# EAGLE design lab2_task2 (EAGLE 6.5.0)
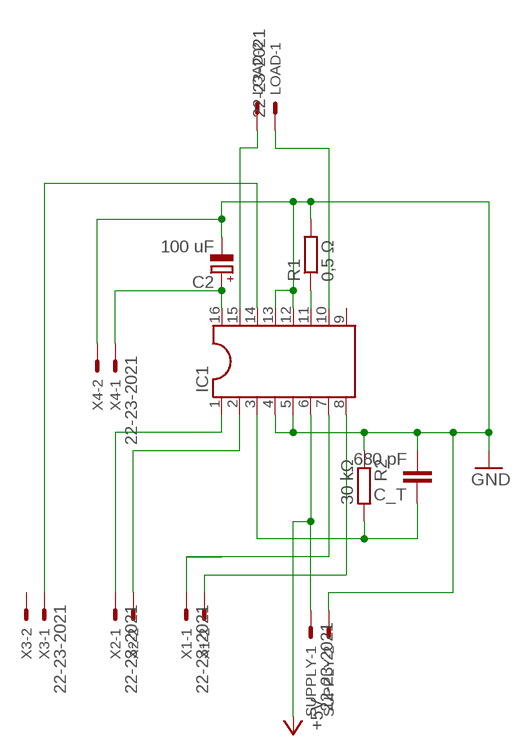
[diagram p0: schematic, sheet 1]

## Parts
C2  100 uF  CPOL-EUE5-13  [E5-13]
C_T  680 pF  C-EU050-035X075  [C050-035X075]
IC1  DIL16  [DIL16]
LOAD  22-23-2021  [22-23-2021]
R1  0,5 Ω  R-EU_0207/10  [0207/10]
R2  30 kΩ  R-EU_0207/10  [0207/10]
SUPPLY  22-23-2021  [22-23-2021]
X1  22-23-2021  [22-23-2021]
X2  22-23-2021  [22-23-2021]
X3  22-23-2021  [22-23-2021]
X4  22-23-2021  [22-23-2021]

## Nets
+5V: IC1.6 SUPPLY.1
GND: C2.- C_T.2 IC1.4 IC1.5 IC1.12 IC1.13 R1.2 R2.1 SUPPLY.2 X4.2
N$1: IC1.7 X1.1
N$2: IC1.8 X1.2
N$3: C_T.1 IC1.3 R2.2
N$4: C2.+ IC1.16 X4.1
N$6: IC1.11 R1.1
N$7: IC1.2 X2.2
N$8: IC1.10 LOAD.1
N$9: IC1.1 X2.1
N$11: IC1.15 LOAD.2
N$13: IC1.14 X3.1
Unconnected: IC1.9 X3.2

## Library data of the parts
C2 = resistor:CPOL-EU: POLARIZED CAPACITOR, European symbol
C_T = resistor:C-EU: CAPACITOR, European symbol
IC1 = ic-package:DIL16: Dual In Line / Socket
LOAD SUPPLY X1-X4 = con-molex:22-23-2021: .100" (2.54mm) Center Header - 2 Pin; MF: MOLEX; MPN: 22-23-2021; OC_FARNELL: 1462926; OC_NEWARK: 25C3832
R1 R2 = resistor:R-EU_: RESISTOR, European symbol

## Board
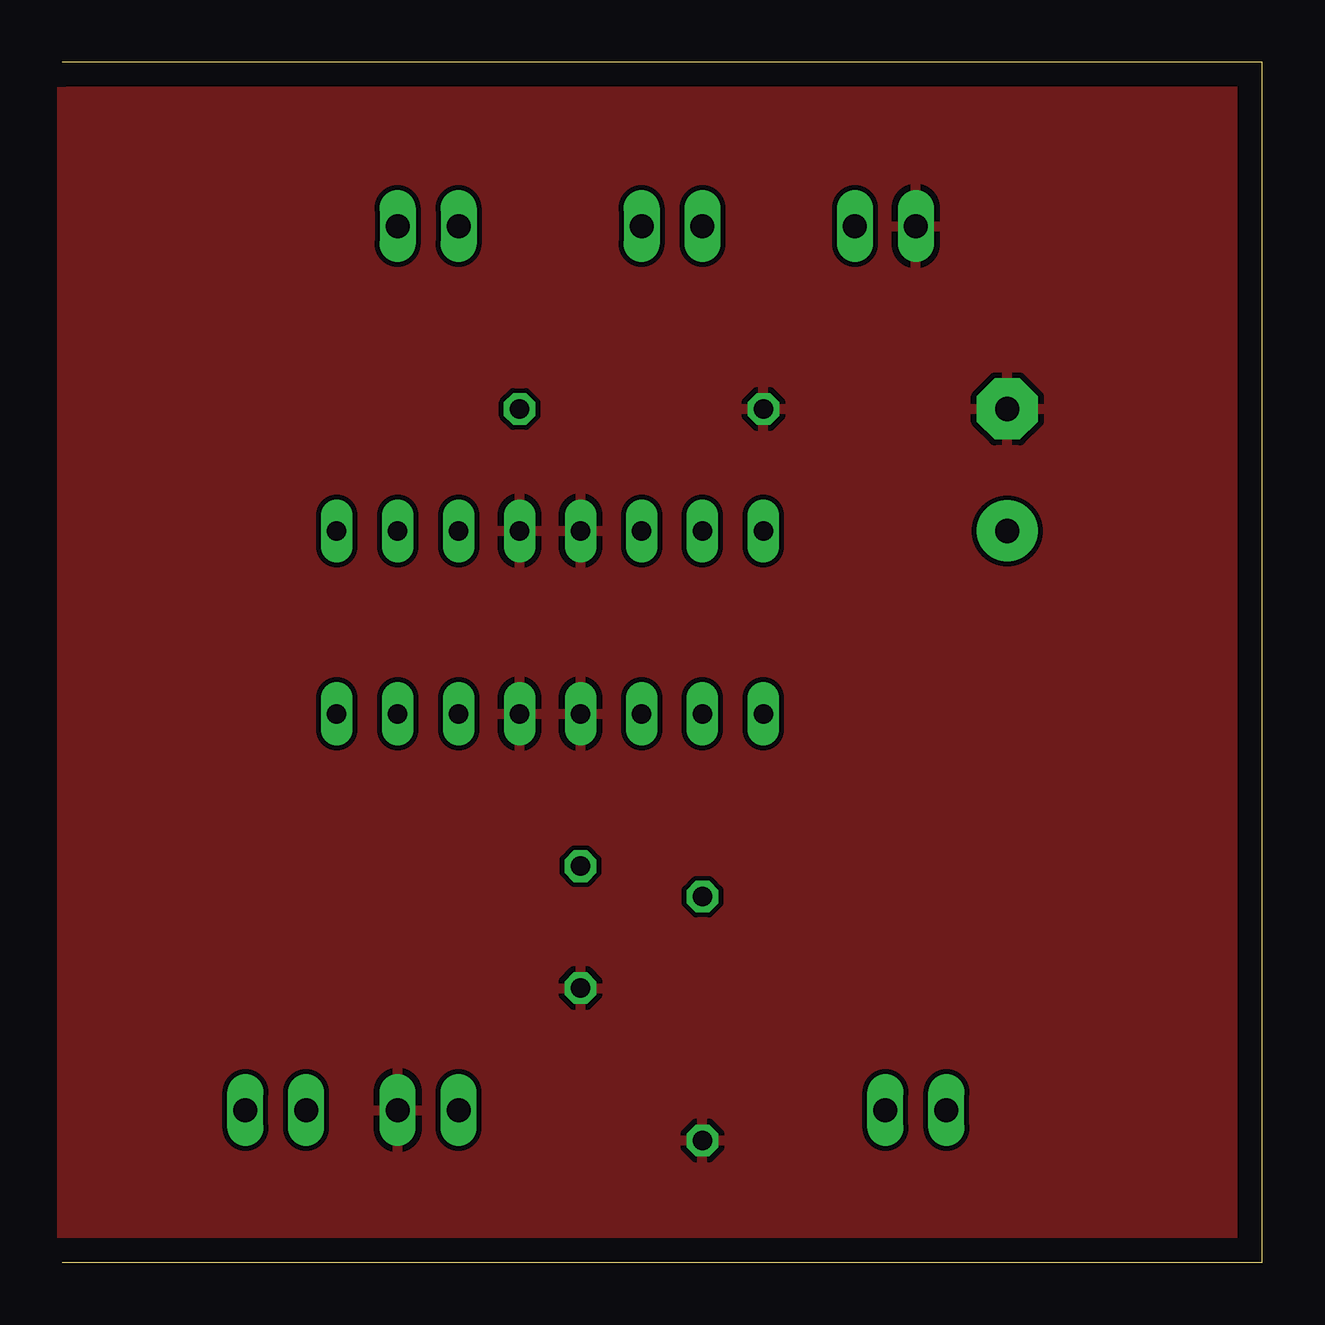
[diagram p1: board, top side]
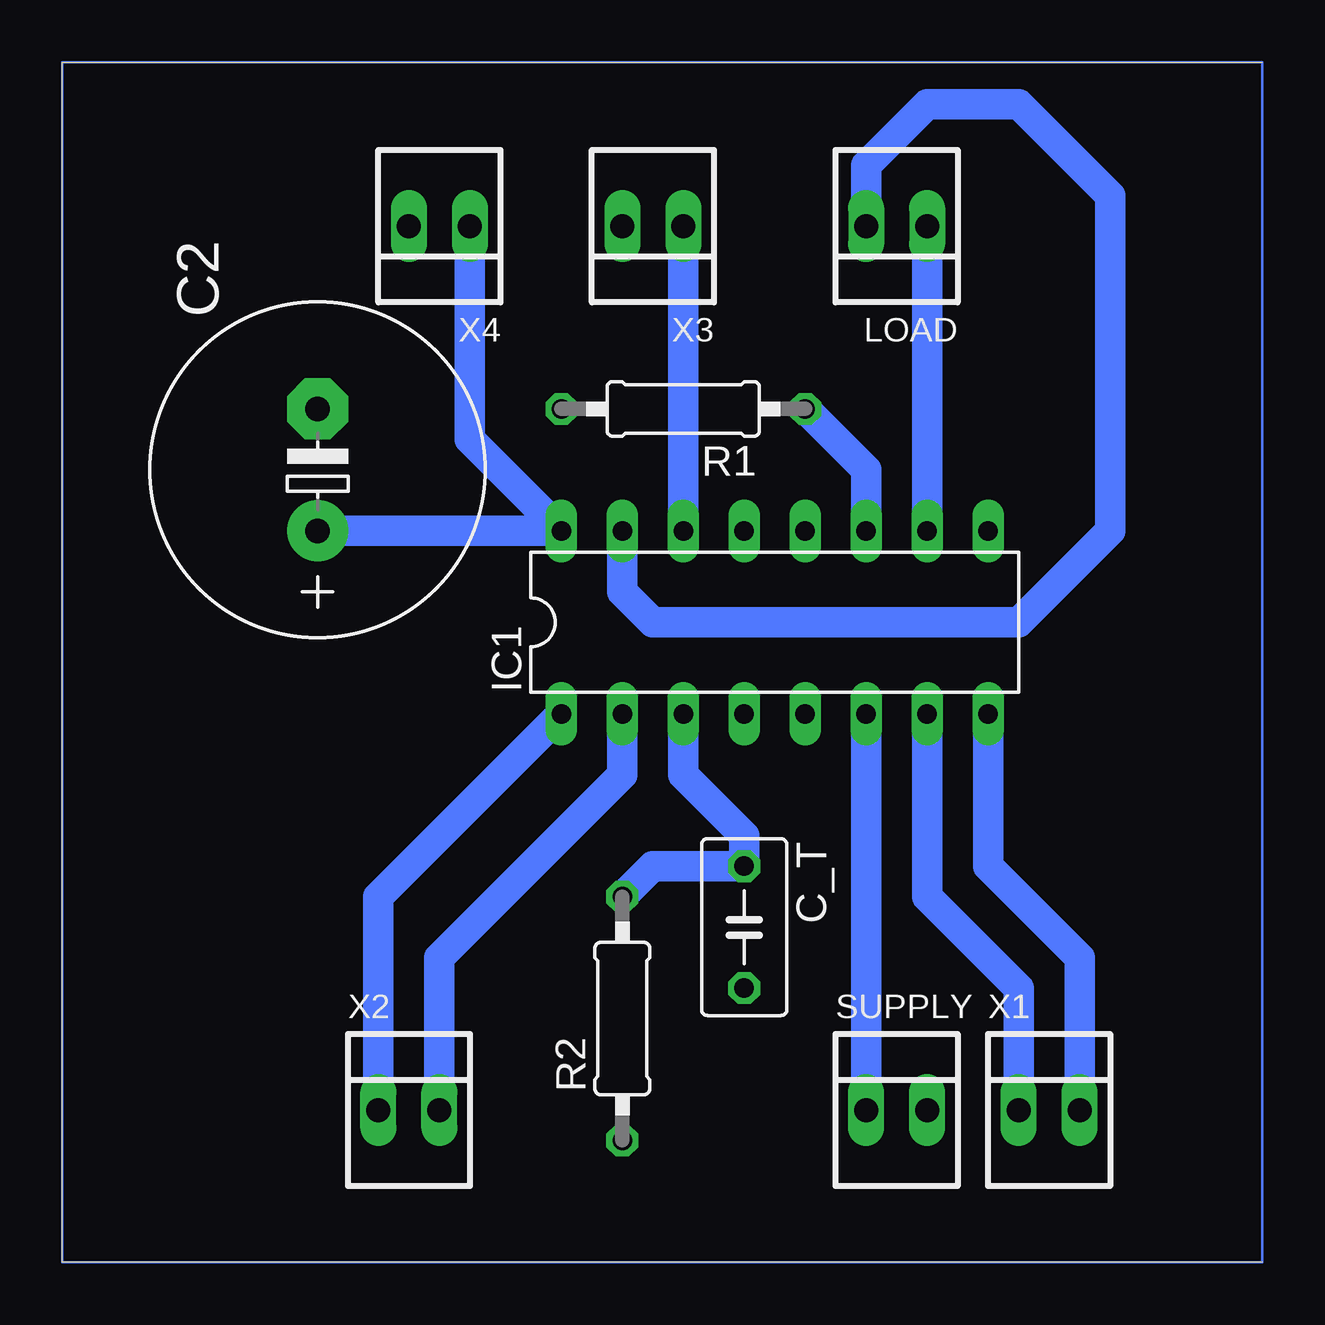
[diagram p2: board, bottom side, seen from below]

Size 50 x 50 mm. Coordinates in mm from the lower left corner, seen from the top.
Outline: 0,0 50,0 50,50 0,50
Copper layers (1*16): Top 0.035mm / dielectric 1.5mm / Bottom 0.035mm
Design rules "default": minimum track width 10mil, minimum drill 24mil, track to track 8mil, track to pad 8mil, pad to pad 8mil, via to via 8mil, smd to smd 8mil, copper to edge 40mil, drill to drill 8mil, minimum pad ring 10mil, minimum via ring 8mil, stop-mask expansion 4mil, vias tented up to drill 0mil, thermal gap 10mil

### Footprints (pad centres in the part's own frame; a part is rotated, then mirrored left to right if it is on the bottom)
E5-13 = drill 1.016 pad 2.54: + -2.54,0 | drill 1.016 pad 2.54 octagon: - 2.54,0
C050-035X075 = drill 0.813 octagon: 1 -2.54,0; 2 2.54,0
DIL16 = drill 0.813 long: 1 -8.89,-3.81; 2 -6.35,-3.81; 3 -3.81,-3.81; 4 -1.27,-3.81; 5 1.27,-3.81; 6 3.81,-3.81; 7 6.35,-3.81; 8 8.89,-3.81; 9 8.89,3.81; 10 6.35,3.81; 11 3.81,3.81; 12 1.27,3.81; 13 -1.27,3.81; 14 -3.81,3.81; 15 -6.35,3.81; 16 -8.89,3.81
22-23-2021 = drill 1 long: 1 -1.27,0; 2 1.27,0
0207/10 = drill 0.813 octagon: 1 -5.08,0; 2 5.08,0

### Placement (x,y rotation side)
C2  39.37,33.02 90 bottom
C_T  21.59,13.97 270 bottom
IC1  20.32,26.67 0 bottom
LOAD  15.24,43.18 180 bottom
R1  24.13,35.56 180 bottom
R2  26.67,10.16 90 bottom
SUPPLY  15.24,6.35 0 bottom
X1  8.89,6.35 0 bottom
X2  35.56,6.35 0 bottom
X3  25.4,43.18 180 bottom
X4  34.29,43.18 180 bottom

### Tracks (layer width: path | path; a pad name or v marks a point on that pad's centre or on a via)
+5V
  Bottom 1.27: IC1.6 SUPPLY.1
GND
  pour Top: 0,0 0,50 100,50 100,0
N$1
  Bottom 1.27: IC1.7 13.97,15.24 10.16,11.43 X1.1
N$2
  Bottom 1.27: IC1.8 11.43,16.51 7.62,12.7 X1.2
N$3
  Bottom 1.27: R2.2 25.4,16.51 C_T.1 21.59,17.78 24.13,20.32 IC1.3
N$4
  Bottom 1.27: C2.+ IC1.16 33.02,34.29 X4.1
N$6
  Bottom 1.27: IC1.11 16.51,33.02 R1.1
N$7
  Bottom 1.27: X2.2 34.29,12.7 26.67,20.32 IC1.2
N$8
  Bottom 1.27: IC1.10 LOAD.1
N$9
  Bottom 1.27: IC1.1 36.83,15.24 X2.1
N$11
  Bottom 1.27: LOAD.2 16.51,45.72 13.97,48.26 10.16,48.26 6.35,44.45 6.35,30.48 10.16,26.67 25.4,26.67 26.67,27.94 IC1.15
N$13
  Bottom 1.27: IC1.14 X3.1
(copper drawn outside any net)
  shapes: Bottom area x1